# Altium schematic sheet eth.SchDoc
size A3; SheetNumber: 3; SheetTotal: 4
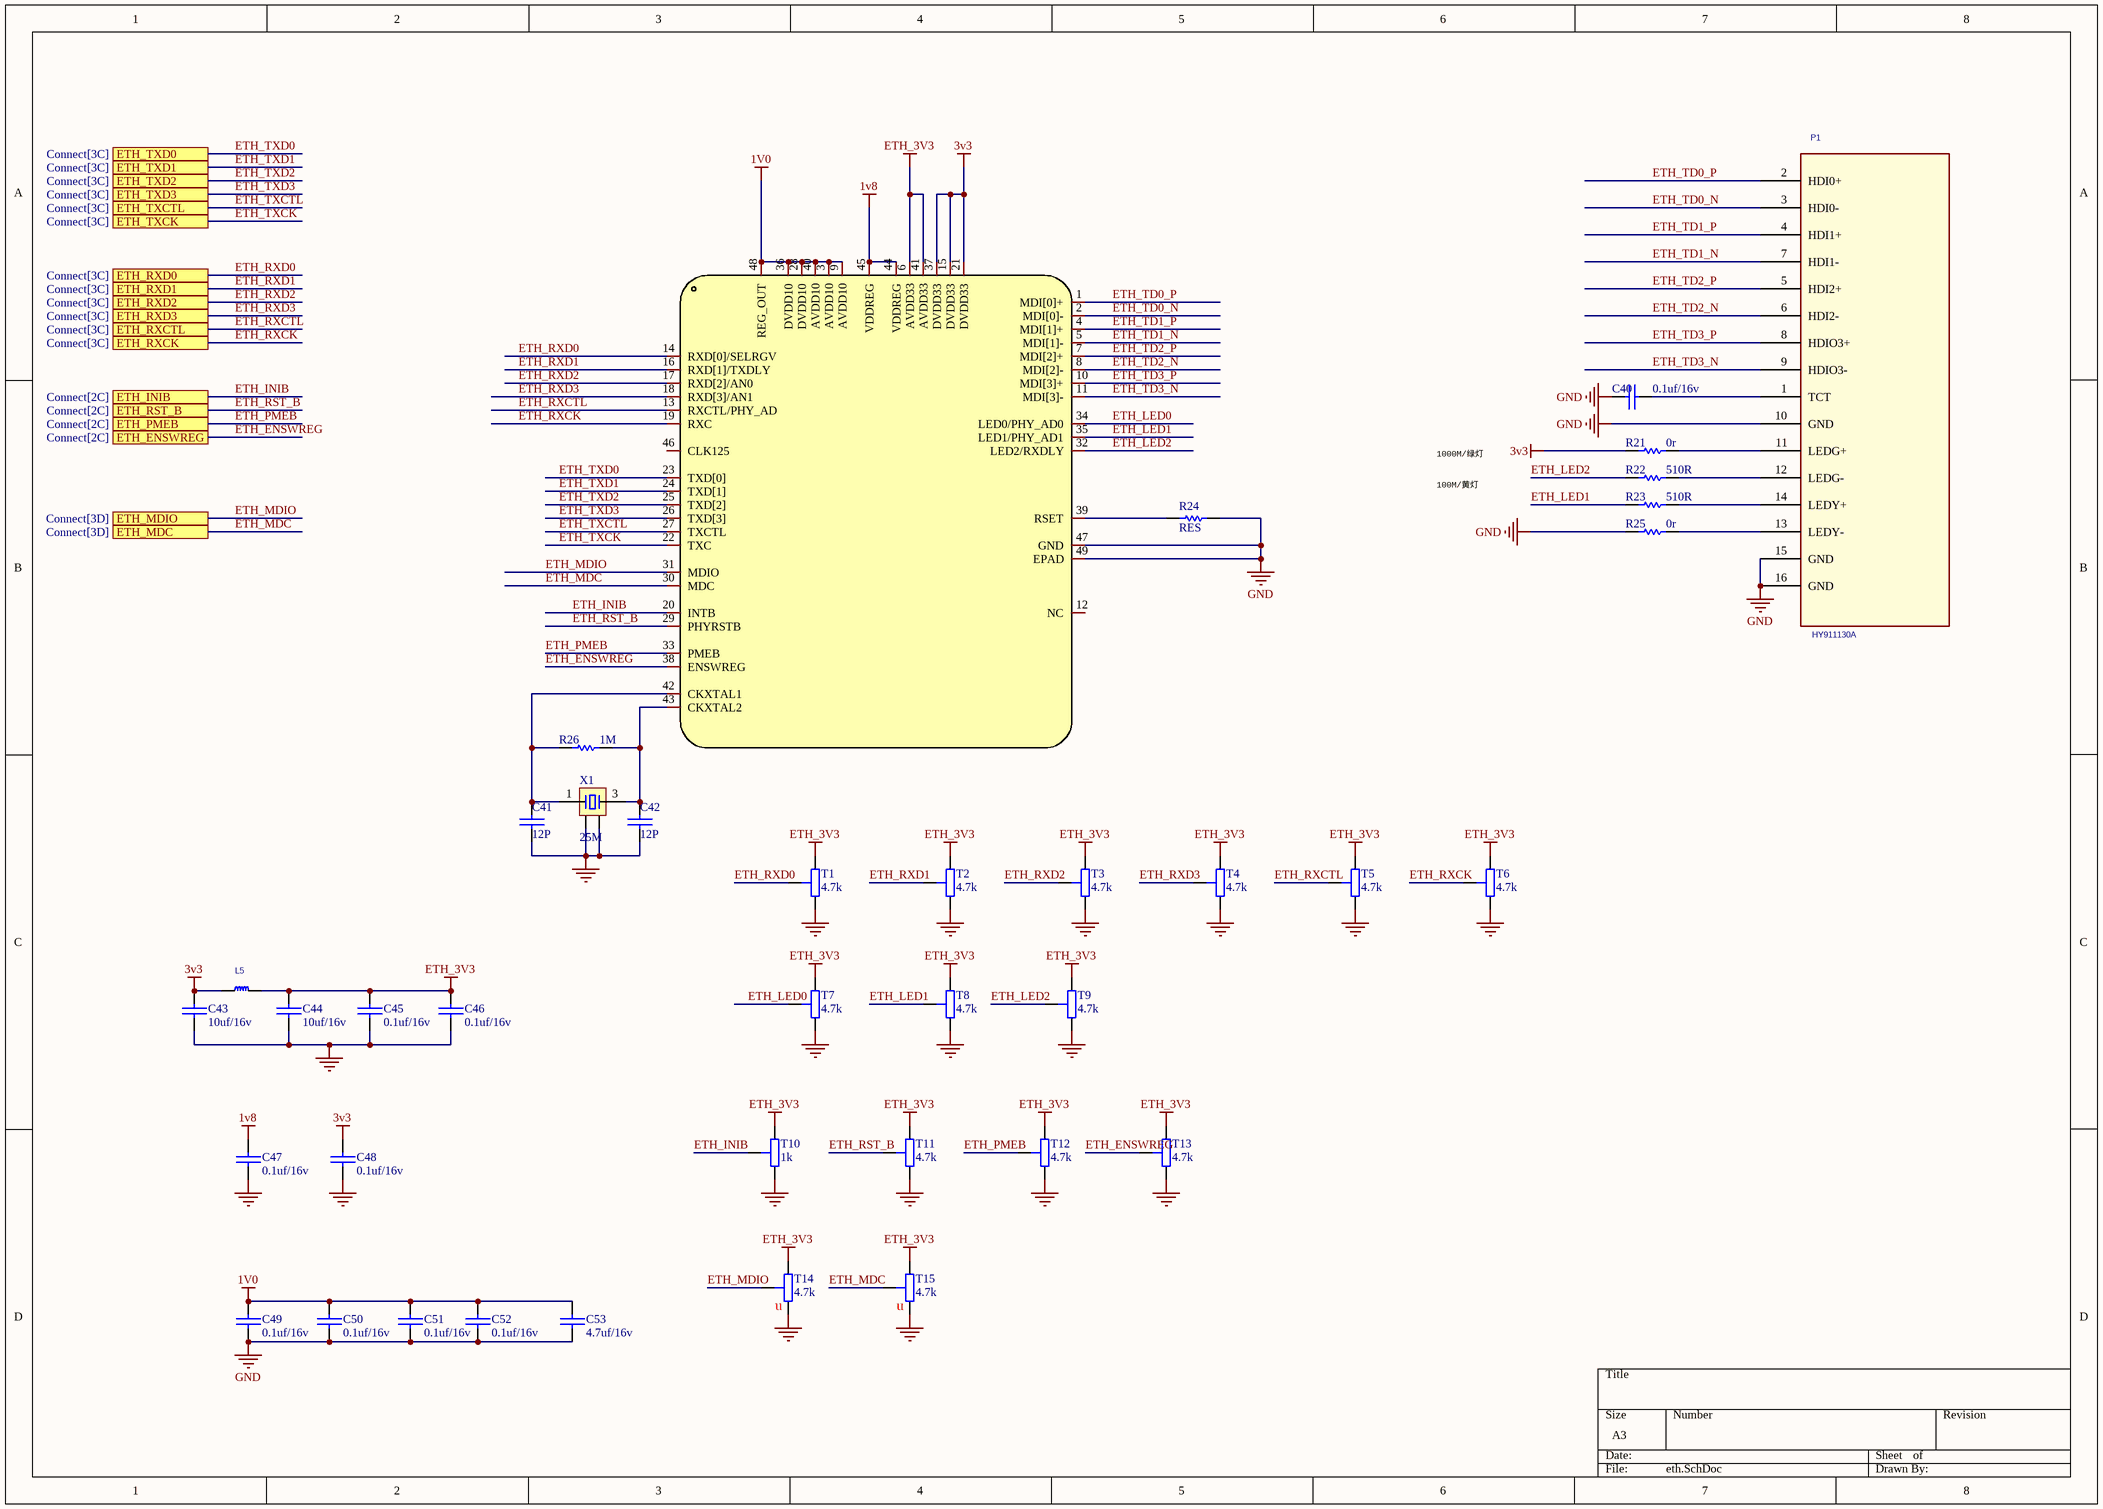
[diagram p0: eth.SchDoc]

## Parts
C40  0.1uf/16v  [0402C]
C41  12P  [0402C]
C42  12P  [0402C]
C43  10uf/16v  [0402C]
C44  10uf/16v  [0402C]
C45  0.1uf/16v  [0402C]
C46  0.1uf/16v  [0402C]
C47  0.1uf/16v  [0402C]
C48  0.1uf/16v  [0402C]
C49  0.1uf/16v  [0402C]
C50  0.1uf/16v  [0402C]
C51  0.1uf/16v  [0402C]
C52  0.1uf/16v  [0402C]
C53  4.7uf/16v  [0402C]
L5  FB  [0402L]  (value not drawn)
P1  HY911130A  [RJ45-TH_HR911130A]
R21  0r  [0402R]
R22  510R  [0402R]
R23  510R  [0402R]
R24  RES  [0402R]
R25  0r  [0402R]
R26  1M  [0402R]
T1  4.7k  [0402T]
T2  4.7k  [0402T]
T3  4.7k  [0402T]
T4  4.7k  [0402T]
T5  4.7k  [0402T]
T6  4.7k  [0402T]
T7  4.7k  [0402T]
T8  4.7k  [0402T]
T9  4.7k  [0402T]
T10  1k  [0402T]
T11  4.7k  [0402T]
T12  4.7k  [0402T]
T13  4.7k  [0402T]
T14  4.7k  [0402T]
T15  4.7k  [0402T]
U4  RTL8211E-VB-CG  [QFN-48_L6.0-W6.0-P0.40-BL-EP3.8]  (value not drawn)
X1  25M  [OSC 3225-4P]

## Ports
ETH_ENSWREG (see Connect[2C]), ETH_INIB (see Connect[2C]), ETH_MDC (see Connect[3D]), ETH_MDIO (see Connect[3D]), ETH_PMEB (see Connect[2C]), ETH_RST_B (see Connect[2C]), ETH_RXCK (see Connect[3C]), ETH_RXCTL (see Connect[3C]), ETH_RXD0 (see Connect[3C]), ETH_RXD1 (see Connect[3C]), ETH_RXD2 (see Connect[3C]), ETH_RXD3 (see Connect[3C]), ETH_TXCK (see Connect[3C]), ETH_TXCTL (see Connect[3C]), ETH_TXD0 (see Connect[3C]), ETH_TXD1 (see Connect[3C]), ETH_TXD2 (see Connect[3C]), ETH_TXD3 (see Connect[3C])

## Nets
1V0: C49.2 C50.2 C51.2 C52.2 C53.2 U4.3(AVDD10) U4.9(AVDD10) U4.28(DVDD10) U4.36(DVDD10) U4.40(AVDD10) U4.48(REG_OUT)
1v8: C47.2 U4.44(VDDREG) U4.45(VDDREG)
3v3: C43.2 C48.2 L5.1 R21.2 U4.15(DVDD33) U4.21(DVDD33) U4.37(DVDD33)
ETH_3V3: C44.2 C45.2 C46.2 L5.2 T1.3 T2.3 T3.3 T4.3 T5.3 T6.3 T7.3 T8.3 T9.3 T10.3 T11.3 T12.3 T13.3 T14.3 T15.3 U4.6(AVDD33) U4.41(AVDD33)
GND: C40.2 C41.1 C42.1 C43.1 C44.1 C45.1 C46.1 C47.1 C48.1 C49.1 C50.1 C51.1 C52.1 C53.1 P1.10(GND) P1.15(GND) P1.16(GND) R24.2 R25.2 T1.2 T2.2 T3.2 T4.2 T5.2 T6.2 T7.2 T8.2 T9.2 T10.2 T11.2 T12.2 T13.2 T14.2 T15.2 U4.47(GND) U4.49(EPAD) X1.2 X1.4
ETH_ENSWREG: T13.1 U4.38(ENSWREG) ; port ETH_ENSWREG
ETH_INIB: T10.1 U4.20(INTB) ; port ETH_INIB
ETH_LED0: T7.1 U4.34(LED0/PHY_AD0)
ETH_LED1: R23.2 T8.1 U4.35(LED1/PHY_AD1)
ETH_LED2: R22.2 T9.1 U4.32(LED2/RXDLY)
ETH_MDC: T15.1 U4.30(MDC) ; port ETH_MDC
ETH_MDIO: T14.1 U4.31(MDIO) ; port ETH_MDIO
ETH_PMEB: T12.1 U4.33(PMEB) ; port ETH_PMEB
ETH_RST_B: T11.1 U4.29(PHYRSTB) ; port ETH_RST_B
ETH_RXCK: T6.1 U4.19(RXC) ; port ETH_RXCK
ETH_RXCTL: T5.1 U4.13(RXCTL/PHY_AD) ; port ETH_RXCTL
ETH_RXD0: T1.1 U4.14(RXD[0]/SELRGV) ; port ETH_RXD0
ETH_RXD1: T2.1 U4.16(RXD[1]/TXDLY) ; port ETH_RXD1
ETH_RXD2: T3.1 U4.17(RXD[2]/AN0) ; port ETH_RXD2
ETH_RXD3: T4.1 U4.18(RXD[3]/AN1) ; port ETH_RXD3
ETH_TD0_N: P1.3(HDI0-) U4.2(MDI[0]-)
ETH_TD0_P: P1.2(HDI0+) U4.1(MDI[0]+)
ETH_TD1_N: P1.7(HDI1-) U4.5(MDI[1]-)
ETH_TD1_P: P1.4(HDI1+) U4.4(MDI[1]+)
ETH_TD2_N: P1.6(HDI2-) U4.8(MDI[2]-)
ETH_TD2_P: P1.5(HDI2+) U4.7(MDI[2]+)
ETH_TD3_N: P1.9(HDIO3-) U4.11(MDI[3]-)
ETH_TD3_P: P1.8(HDIO3+) U4.10(MDI[3]+)
ETH_TXCK: U4.22(TXC) ; port ETH_TXCK
ETH_TXCTL: U4.27(TXCTL) ; port ETH_TXCTL
ETH_TXD0: U4.23(TXD[0]) ; port ETH_TXD0
ETH_TXD1: U4.24(TXD[1]) ; port ETH_TXD1
ETH_TXD2: U4.25(TXD[2]) ; port ETH_TXD2
ETH_TXD3: U4.26(TXD[3]) ; port ETH_TXD3
NetC40_1: C40.1 P1.1(TCT)
NetC41_2: C41.2 R26.1 U4.42(CKXTAL1) X1.1
NetC42_2: C42.2 R26.2 U4.43(CKXTAL2) X1.3
NetP1_11: P1.11(LEDG+) R21.1
NetP1_12: P1.12(LEDG-) R22.1
NetP1_13: P1.13(LEDY-) R25.1
NetP1_14: P1.14(LEDY+) R23.1
NetR24_1: R24.1 U4.39(RSET)

Not connected (* = marked no-connect by the designer): U4 12(NC) 46(CLK125)

## Notes on the sheet
- 1000M/绿灯
- 100M/黄灯
- (near T14) u
- (near T15) u

## Library data of the parts
C40-C53 = CAP: 无极性电容
L5 = FB: 铁氧体磁珠
P1 = HY911130A: RJ45
R21-R26 = RES: 电阻
T1-T15 = test: 调试
U4 = RTL8211E-VB-CG: 千兆以太网控制芯片; Manufacturer: REALTEK(瑞昱); Add into BOM: yes; Application Function: 以太网收发器; Interface: GMII, MII, RGMII; Supply Voltage: 1.43V~3.63V; Name: RTL8211E-VB-CG; Symbol: RTL8211E-VB-CG; Device: RTL8211E-VB-CG; LCSC Part Name: RTL8211E-VB-CG; Supplier Part: C90735; Manufacturer Part: RTL8211E-VB-CG; Supplier Footprint: QFN-48-EP(6x6); JLCPCB Part Class: Extended Part; Datasheet: https://atta.szlcsc.com/upload/public/pdf/source/20171225/C90735_15141884815701203317.pdf; Supplier: LCSC; Convert to PCB: yes; Number of Channels: -
X1 = XTAL-4P: 4脚无源晶振